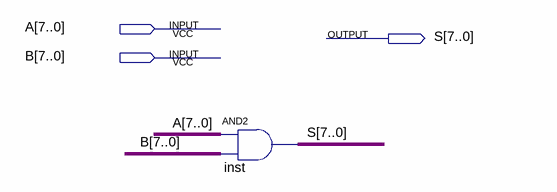
[diagram p0: schematic sheet]
// Quartus schematic AND8b.bdf as structural Verilog: 1 symbols, 3 pins
module AND8b (
  input  [7:0] A,
  input  [7:0] B,
  output [7:0] S
);

  assign S = A & B;  // AND2 inst, 8 bits wide
endmodule
